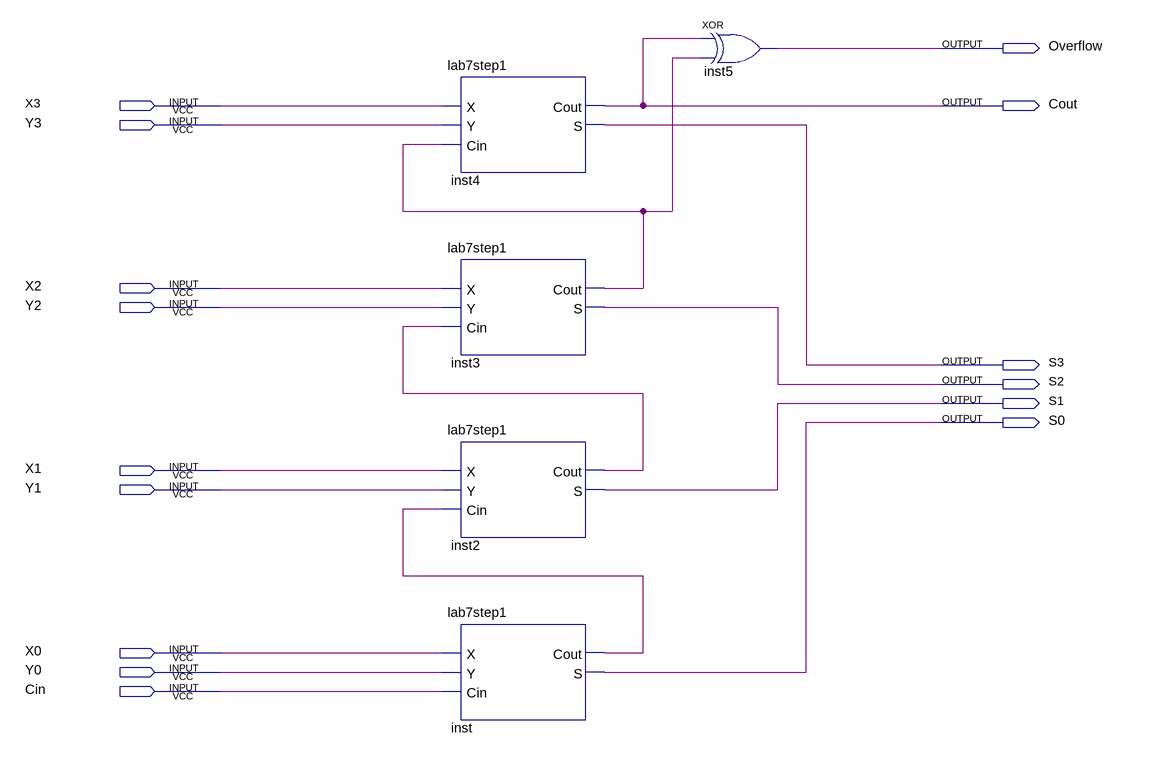
[diagram p0: schematic sheet]
// Quartus schematic lab7step2.bdf as structural Verilog: 5 symbols, 15 pins
module lab7step2 (
  input  X3,
  input  Y3,
  input  X2,
  input  Y2,
  input  X1,
  input  Y1,
  input  X0,
  input  Y0,
  input  Cin,
  output Overflow,
  output Cout,
  output S3,
  output S2,
  output S1,
  output S0
);

  wire inst2_cout, inst3_cout, inst_cout;

  lab7step1 inst4 (.Cin(inst3_cout), .X(X3), .Y(Y3), .S(S3), .Cout(Cout));
  lab7step1 inst3 (.Cin(inst2_cout), .X(X2), .Y(Y2), .S(S2), .Cout(inst3_cout));
  lab7step1 inst2 (.Cin(inst_cout), .X(X1), .Y(Y1), .S(S1), .Cout(inst2_cout));
  lab7step1 inst (.Cin(Cin), .X(X0), .Y(Y0), .S(S0), .Cout(inst_cout));
  xor inst5 (Overflow, Cout, inst3_cout);
endmodule
